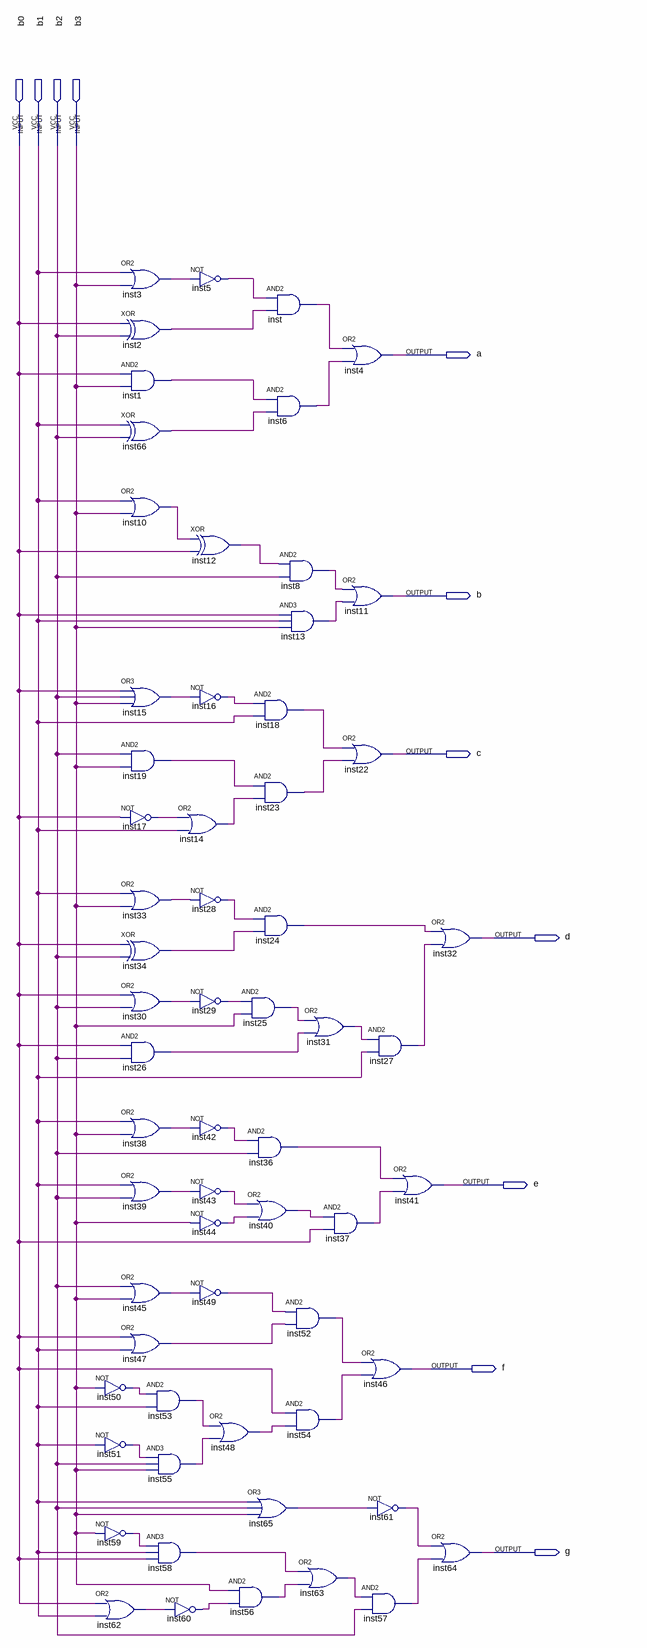
[diagram p0: schematic sheet]
// Quartus schematic proj-aula05-uso-do-quartus.bdf as structural Verilog: 62 symbols, 11 pins
module \proj-aula05-uso-do-quartus  (
  input  b0,
  input  b1,
  input  b2,
  input  b3,
  output a,
  output b,
  output c,
  output d,
  output e,
  output f,
  output g
);

  wire inst1_out, inst2_out, inst3_out, inst5_out, inst6_out, inst8_out, inst10_out, inst12_out, inst13_out,
       inst14_out, inst15_out, inst16_out, inst17_out, inst18_out, inst19_out, inst23_out, inst24_out,
       inst25_out, inst26_out, inst27_out, inst28_out, inst29_out, inst30_out, inst31_out, inst33_out,
       inst34_out, inst36_out, inst37_out, inst38_out, inst39_out, inst40_out, inst42_out, inst43_out,
       inst44_out, inst45_out, inst47_out, inst48_out, inst49_out, inst50_out, inst51_out, inst52_out,
       inst53_out, inst54_out, inst55_out, inst56_out, inst57_out, inst58_out, inst59_out, inst60_out,
       inst61_out, inst62_out, inst63_out, inst65_out, inst66_out, inst_out;

  not inst50 (inst50_out, b3);
  not inst51 (inst51_out, b1);
  not inst59 (inst59_out, b3);
  or inst62 (inst62_out, b0, b1);
  or inst3 (inst3_out, b1, b3);
  xor inst2 (inst2_out, b0, b2);
  and inst1 (inst1_out, b0, b3);
  xor inst66 (inst66_out, b1, b2);
  or inst10 (inst10_out, b1, b3);
  or inst15 (inst15_out, b0, b2, b3);
  and inst19 (inst19_out, b2, b3);
  not inst17 (inst17_out, b0);
  or inst33 (inst33_out, b1, b3);
  xor inst34 (inst34_out, b0, b2);
  or inst30 (inst30_out, b0, b2);
  and inst26 (inst26_out, b0, b2);
  or inst38 (inst38_out, b1, b3);
  or inst39 (inst39_out, b1, b2);
  or inst45 (inst45_out, b2, b3);
  or inst47 (inst47_out, b0, b1);
  and inst53 (inst53_out, inst50_out, b1);
  and inst55 (inst55_out, inst51_out, b2, b3);
  and inst58 (inst58_out, inst59_out, b1, b0);
  not inst5 (inst5_out, inst3_out);
  xor inst12 (inst12_out, inst10_out, b0);
  not inst16 (inst16_out, inst15_out);
  or inst14 (inst14_out, inst17_out, b1);
  not inst28 (inst28_out, inst33_out);
  not inst29 (inst29_out, inst30_out);
  not inst42 (inst42_out, inst38_out);
  not inst43 (inst43_out, inst39_out);
  not inst44 (inst44_out, b3);
  not inst49 (inst49_out, inst45_out);
  not inst60 (inst60_out, inst62_out);
  and inst18 (inst18_out, inst16_out, b1);
  and inst23 (inst23_out, inst19_out, inst14_out);
  and inst24 (inst24_out, inst28_out, inst34_out);
  and inst25 (inst25_out, inst29_out, b3);
  and inst36 (inst36_out, inst42_out, b2);
  or inst40 (inst40_out, inst43_out, inst44_out);
  or inst48 (inst48_out, inst53_out, inst55_out);
  or inst65 (inst65_out, b1, b2, b3);
  and inst56 (inst56_out, b3, inst60_out);
  and inst (inst_out, inst5_out, inst2_out);
  and inst6 (inst6_out, inst1_out, inst66_out);
  and inst8 (inst8_out, inst12_out, b2);
  and inst13 (inst13_out, b0, b1, b3);
  or inst31 (inst31_out, inst25_out, inst26_out);
  and inst52 (inst52_out, inst49_out, inst47_out);
  and inst54 (inst54_out, b0, inst48_out);
  or inst63 (inst63_out, inst58_out, inst56_out);
  or inst4 (a, inst_out, inst6_out);
  or inst11 (b, inst8_out, inst13_out);
  or inst22 (c, inst18_out, inst23_out);
  and inst37 (inst37_out, inst40_out, b0);
  and inst27 (inst27_out, inst31_out, b1);
  or inst41 (e, inst36_out, inst37_out);
  or inst46 (f, inst52_out, inst54_out);
  not inst61 (inst61_out, inst65_out);
  and inst57 (inst57_out, inst63_out, b2);
  or inst32 (d, inst24_out, inst27_out);
  or inst64 (g, inst61_out, inst57_out);
endmodule
